# EAGLE schematic conv_rs232-ttl_-comparadores (EAGLE 6.1)
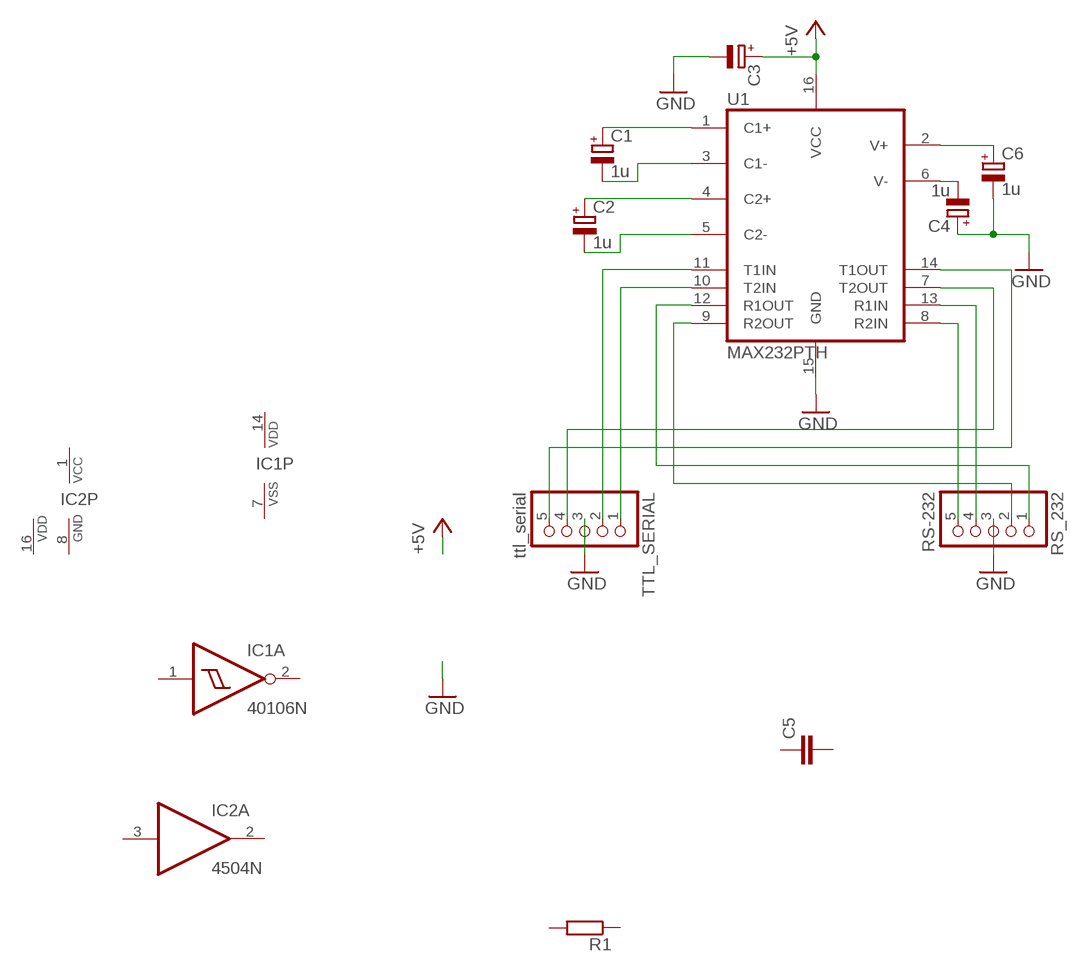
[diagram p0: schematic, sheet 1]

## Parts
C1  1u  CPOL-EUE2-4  [E2-4]
C2  1u  CPOL-EUE2-4  [E2-4]
C3  CPOL-EUE2-4  [E2-4]
C4  1u  CPOL-EUE2-4  [E2-4]
C5  C-EU025-025X050  [C025-025X050]
C6  1u  CPOL-EUE2-4  [E2-4]
IC1  40106N  [DIL14]
IC2  4504N  [DIL16]
R1  R-EU_0204/5  [0204/5]
RS_232  RS-232  PINHD-1X5  [1X05]
TTL_SERIAL  ttl_serial  PINHD-1X5  [1X05]
U1  MAX232PTH  [DIL16]

## Nets
+5V: C3.+ U1.16(VCC)
GND: C3.- C4.+ C6.- RS_232.3 TTL_SERIAL.3 U1.15(GND)
N$1: C1.+ U1.1(C1+)
N$2: C1.- U1.3(C1-)
N$3: C2.+ U1.4(C2+)
N$4: C2.- U1.5(C2-)
N$5: C4.- U1.6(V-)
N$6: C6.+ U1.2(V+)
N$7: RS_232.5 U1.8(R2IN)
N$8: RS_232.4 U1.13(R1IN)
N$9: RS_232.2 U1.9(R2OUT)
N$10: RS_232.1 U1.12(R1OUT)
N$11: TTL_SERIAL.1 U1.10(T2IN)
N$12: TTL_SERIAL.2 U1.11(T1IN)
N$13: TTL_SERIAL.4 U1.7(T2OUT)
N$14: TTL_SERIAL.5 U1.14(T1OUT)
Unconnected: C5.1 C5.2 IC1.1(A:I) IC1.2(A:O) IC1.3(B:I) IC1.4(B:O) IC1.5(C:I) IC1.6(C:O) IC1.8(D:O) IC1.9(D:I) IC1.10(E:O) IC1.11(E:I) IC1.12(F:O) IC1.13(F:I) IC2.2(A:O) IC2.3(A:I) IC2.4(B:O) IC2.5(B:I) IC2.6(C:O) IC2.7(C:I) IC2.9(D:I) IC2.10(D:O) IC2.11(E:I) IC2.12(E:O) IC2.13 IC2.14(F:I) IC2.15(F:O) R1.1 R1.2

## Power pins joined to a net without a drawn wire
GND: IC2.8(P:GND)
VCC: IC2.1(P:VCC)
VDD: IC1.14(P:VDD) IC2.16(P:VDD)
VSS: IC1.7(P:VSS)

## Library data of the parts
C1-C4 C6 = rcl:CPOL-EU: POLARIZED CAPACITOR, European symbol
C5 = rcl:C-EU: CAPACITOR, European symbol
IC1 = 40xx:40106: Hex SCHMITT TRIGGER
IC2 = 45xx:4504: TTL or CMOS to CMOS hex LEVEL SHIFTER
R1 = rcl:R-EU_: RESISTOR, European symbol
RS_232 TTL_SERIAL = pinhead:PINHD-1X5: PIN HEADER
U1 = SparkFun:MAX232: RS232 Transceiver Very common IC. This is generically called 'MAX232', but works with the 3V equivalent MAX3232 generic ICs. Field tested and mother approved. Spark Fun Electronics SKU : COM-00316 (DIP) and COM-00589 (SMD)